# EAGLE design 451_mic (EAGLE 9.6.2)
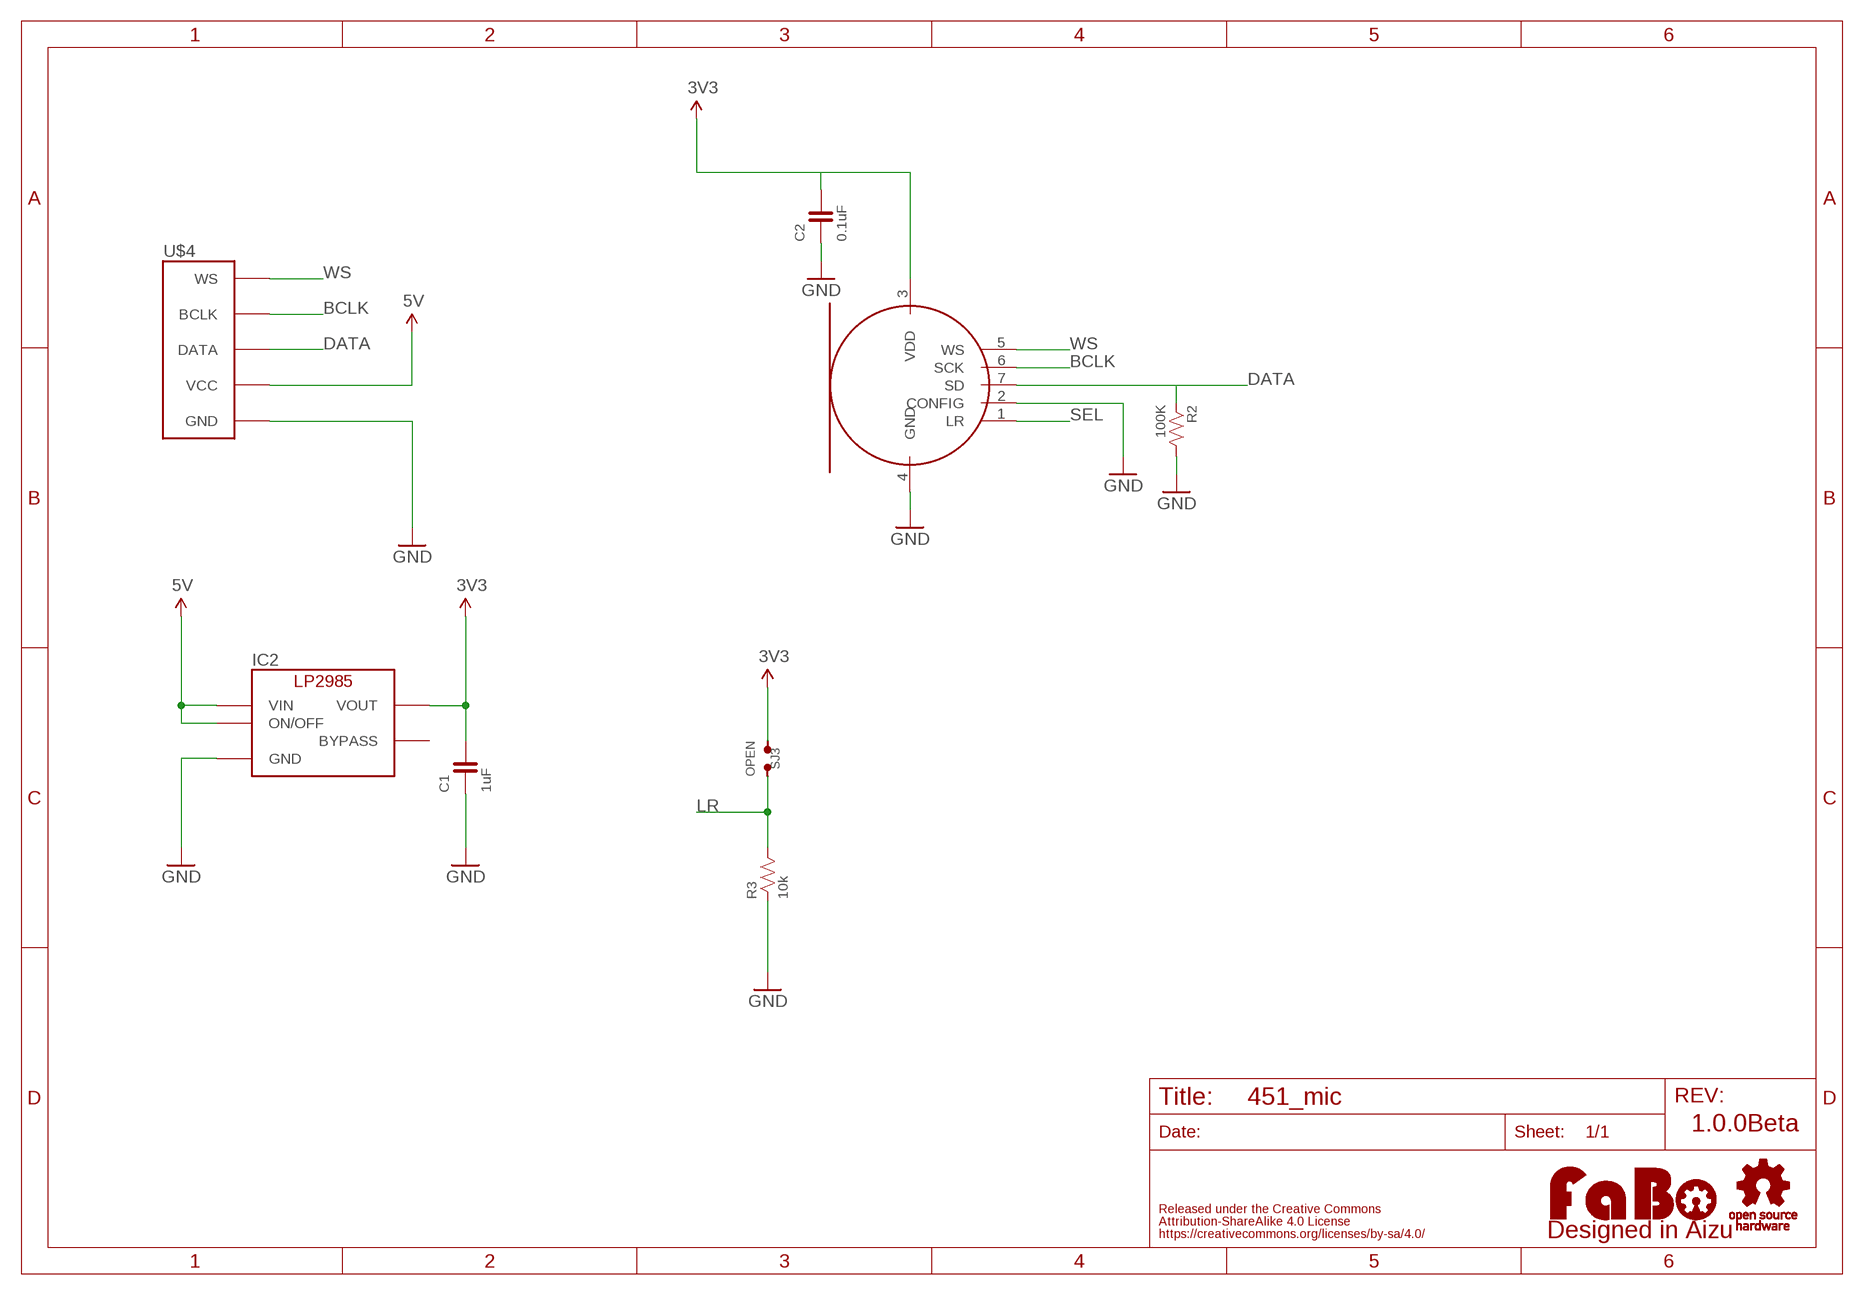
[diagram p0: schematic, sheet 1]

## Parts
C1  1uF  CAPACITOR-0603  [0603]
C2  0.1uF  CAPACITOR-0603  [0603]
IC2  LP2985-33DBV  [SOT-23-5]
LOGO1  LOGO_FABO-M_BOTTOM  [LOGO_FABO_M_BOTTOM]
MIC  TDK-ICS43432  [TDK-ICS43432]
R2  100K  RESISTOR-0603  [0603]
R3  10k  RESISTOR-0603  [0603]
SJ3  OPEN  SMD-JUMPER-2-OPEN  [SMD-JUMPER-2-OPEN]
U$2  LOGO_OSHW-M_BOTTOM  [LOGO_OSHW_M_BOTTOM]
U$4  FABO_BRICK_I2S  [FABO_BRICK_I2S]

## Nets
3V3: C1.2 C2.2 IC2.5(VOUT) MIC.3(VDD) SJ3.1
5V: IC2.1(VIN) IC2.3(ON/OFF) U$4.VCC
BCLK: MIC.6(SCK) U$4.BCLK
DATA: MIC.7(SD) R2.1 U$4.DATA
GND: C1.1 C2.1 IC2.2(GND) MIC.2(CONFIG) MIC.4(GND) R2.2 R3.1 U$4.GND
LR: R3.2 SJ3.2
SEL: MIC.1(LR)
WS: MIC.5(WS) U$4.WS
Unconnected: IC2.4(BYPASS)

## Notes on the sheet
- 1.0.0Beta

## Library data of the parts
C1 C2 = FaBo-Capacitor:CAPACITOR: CAPACITOR
IC2 = FaBo-Supply:LP2985: LP2985
LOGO1 = component:LOGO_FABO
MIC = FaBo-Mems:TDK-ICS43432
R2 R3 = FaBo-Resistors:RESISTOR: RESISTOR
SJ3 = FaBo-Supply:SMD-JUMPER-2
U$2 = component:LOGO_OSHW
U$4 = FaBo-Template:FABO_BRICK_I2S

## Board
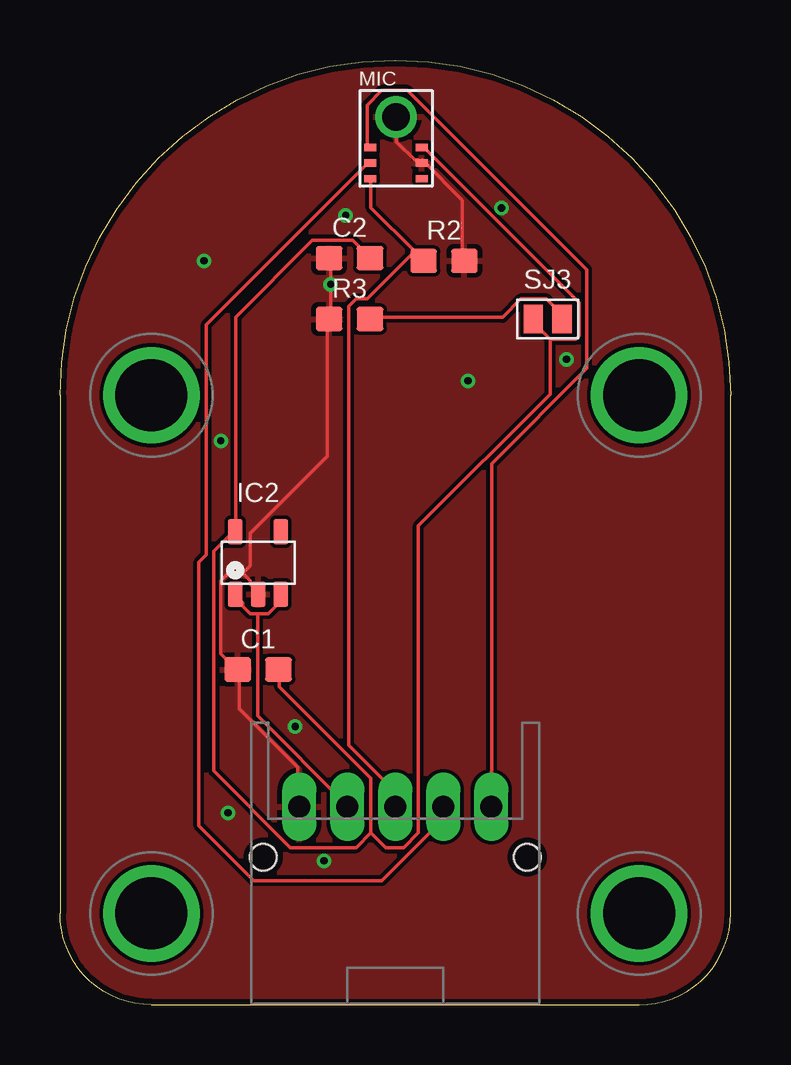
[diagram p1: board, top side]
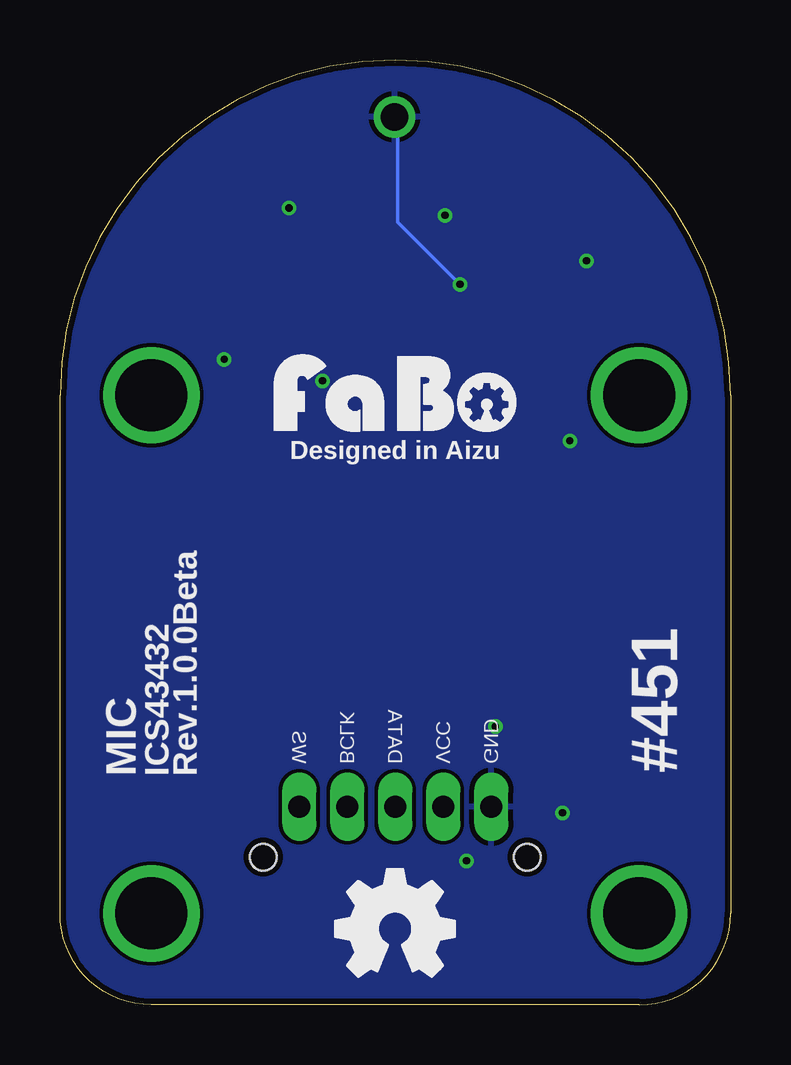
[diagram p2: board, bottom side, seen from below]

Size 27.94 x 39.37 mm. Coordinates in mm from the lower left corner, seen from the top.
Copper layers (1*16): Top 0.035mm / dielectric 1.6mm / Bottom 0.035mm
Design rules "PCBway": minimum track width 6mil, minimum drill 12mil, track to track 6mil, track to pad 6mil, pad to pad 6mil, via to via 6mil, smd to smd 6mil, copper to edge 10mil, drill to drill 10mil, minimum pad ring 10mil, minimum via ring 6mil, stop-mask expansion 2mil, vias tented up to drill 100mil, thermal gap 8mil

### Footprints (pad centres in the part's own frame; a part is rotated, then mirrored left to right if it is on the bottom)
0603 = smd 1.1 x 1: 1 -0.85,0; 2 0.85,0
SOT-23-5 = smd 0.6 x 1.05: 1 -0.95,-1.3; 2 0,-1.3; 3 0.95,-1.3; 4 0.95,1.3; 5 -0.95,1.3
TDK-ICS43432 = smd 0.5 x 0.3: 1 1.075,-2.575; 2 1.075,-1.925; 3 1.075,-1.275; 5 -1.075,-1.275; 6 -1.075,-1.925; 7 -1.075,-2.575 | drill 1.15 pad 1.65: 4 0,0
SMD-JUMPER-2-OPEN = smd 0.8 x 1.2: 1 -0.6,0; 2 0.6,0
FABO_BRICK_I2S = drill 0.9 pad 1.422 long: BCLK 2,-9.525; DATA 0,-9.525; GND -4,-9.525; VCC -2,-9.525; WS 4,-9.525 | drill 3 pad 3.81: P$1 -10.16,7.62; P$2 10.16,7.62; P$3 -10.16,-13.97; P$4 10.16,-13.97 | hole 1.1: -5.5,-11.625; 5.5,-11.625

### Placement (x,y rotation side)
C1  8.26,13.97 0 top
C2  12.06,31.11 0 top
IC2  8.26,18.41 0 top
LOGO1  13.97,23.5 0 top
MIC  14,37 0 top
R2  16,31 0 top
R3  12.06,28.57 0 top
SJ3  20.32,28.57 0 top
U$2  13.97,3.17 0 top
U$4  13.97,17.78 0 top

### Tracks (layer width: path | path; a pad name or v marks a point on that pad's centre or on a via)
3V3
  Top 0.152: 20.42,27.74 21.49,27.74 21.64,27.89 21.64,29.26 15.24,35.66 15.09,35.66 MIC.3 | 20.42,27.74 19.66,28.5 SJ3.1 | C2.2 12.8,31.24 12.19,31.85 10.52,31.85 7.32,28.65 7.32,19.81 IC2.5 7.16,19.66 6.4,18.9 6.4,9.75 9.6,6.55 12.34,6.55 12.95,7.16 | 12.95,7.16 12.95,9.45 9.14,13.26 9.14,13.87 C1.2 | 20.42,27.74 20.42,25.45 14.94,19.96 14.94,7.16 14.33,6.55 13.56,6.55 12.95,7.16
5V
  Top 0.152: 8.23,16.31 8.69,16.31 9.14,16.76 9.14,17.07 IC2.3 | 8.23,16.31 7.92,16.31 7.62,16.61 7.62,16.76 7.32,17.07 IC2.1 | 8.23,16.31 8.23,12.04 11.89,8.38 U$4.VCC
BCLK
  Top 0.152: MIC.6 12.8,35.05 6.1,28.35 6.1,18.75 5.79,18.44 5.79,7.47 8.08,5.18 13.41,5.18 15.85,7.62 15.85,8.23 U$4.BCLK
DATA
  Top 0.152: 14.78,31.39 15.09,31.09 R2.1 14.78,31.39 | 14.78,31.39 12.95,33.22 12.95,34.29 MIC.7 | 14.78,31.39 12.8,29.41 12.34,29.41 12.04,29.11 12.04,10.82 13.87,8.99 13.87,8.38 U$4.DATA
GND  (via drill 0.3)
  Top 0.152: MIC.4 14.02,36.88 14.02,35.97 14.78,35.2 14.94,35.2 MIC.2 15.09,35.2 16.76,33.53 16.76,31.09 R2.2 | C2.1 11.28,31.09 v11.28,30.02 11.28,28.65 R3.1 11.12,28.5 11.12,22.86 7.92,19.66 7.92,18.29 7.62,17.98 | 7.62,17.98 7.92,17.68 7.92,17.53 8.23,17.22 IC2.2 | 7.62,17.98 7.01,17.98 6.71,17.68 6.71,14.63 7.32,14.02 C1.1 7.47,13.87 7.47,12.34 9.91,9.91 9.91,8.38 U$4.GND
  Bottom 0.152: v11.28,30.02 13.87,32.61 13.87,36.88 MIC.4
  other vias: 6,31 17,26 7,8 11,6 9.8,11.6 6.7,23.5 21.1,26.9 11.9,32.9 18.4,33.2
  pour Bottom: 0,0 28,0 28,40 0,40
  pour Top: 0,0 28,0 28,40 0,40
LR
  Top 0.152: R3.2 12.95,28.65 18.44,28.65 19.2,29.41 20.27,29.41 21.03,28.65 SJ3.2
WS
  Top 0.152: MIC.5 12.8,35.81 12.8,37.49 13.41,38.1 14.48,38.1 21.95,30.63 21.95,26.52 17.98,22.55 17.98,8.38 U$4.WS

### Text on the board
bPlace: Designed in Aizu | #451 | Rev.1.0.0Beta | ICS43432 | MIC